# Altium project RFID_Reader_Z69.PrjPcb
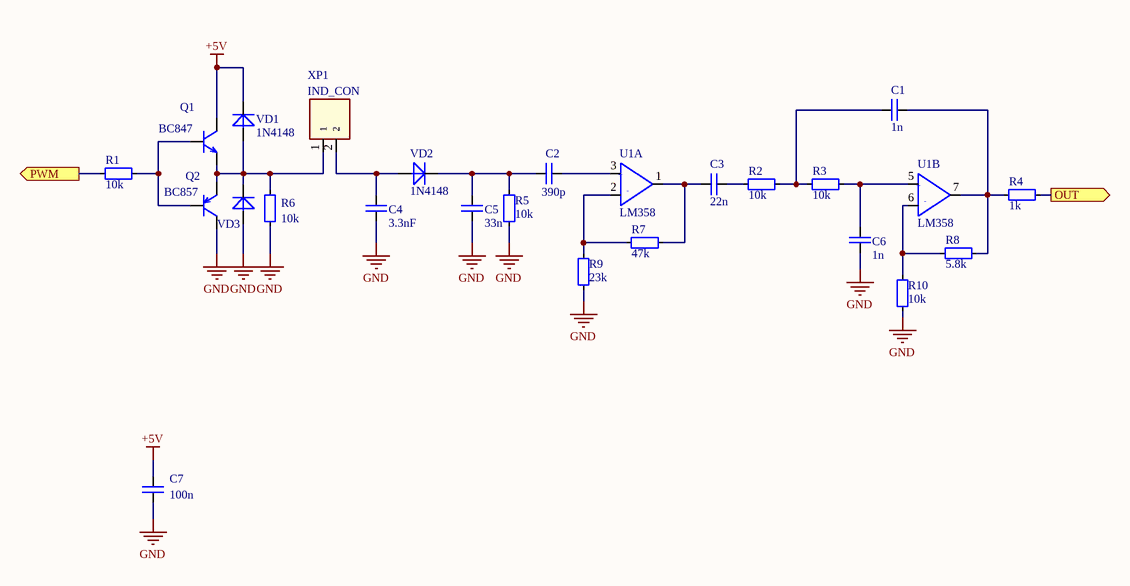
[diagram p0: Analog.SchDoc]
2 sheets, 55 parts. Net scope: flat (ports and power ports of the same name join across sheets).
Board file: PCB.PcbDoc
Sheets:
  Analog.SchDoc
  MCU.SchDoc

## Sheet Analog.SchDoc
size A4

### Parts
C1  1n  [SMD_0805]
C2  390p  [SMD_0805]
C3  22n  [SMD_0805]
C4  3.3nF  [SMD_0805]
C5  33n  [SMD_0805]
C6  1n  [SMD_0805]
C7  100n  [SMD_0805]
Q1  BC847  [SOT23-3PIN]
Q2  BC857  [SOT23-3PIN]
R1  10k  [SMD_1206]
R2  10k  [SMD_0805]
R3  10k  [SMD_0805]
R4  1k  [SMD_1206]
R5  10k  [SMD_0805]
R6  10k  [SMD_0805]
R7  47k  [SMD_0805]
R8  5.8k  [SMD_0805]
R9  23k  [SMD_0805]
R10  10k  [SMD_0805]
U1  LM358  [SO8-150mil]  (parts A,B of 2)
VD1  1N4148  [DIO-MELF_SOD-80]
VD2  1N4148  [DIO-MELF_SOD-80]
VD3  1N4148  [DIO-MELF_SOD-80]  (value not drawn)
XP1  IND_CON  [PIN-HEAD-1/2/2.54]

### Ports
OUT (out), PWM (out)

### Nets
+5V: C7.2 Q1.3(C) U1.8(VCC) VD1.1(C)
GND: C4.1 C5.1 C6.1 C7.1 Q2.3(C) R5.2 R6.2 R9.2 R10.2 U1.4(GND) VD3.2(A)
OUT: R4.1 ; port OUT
PWM: R1.1 ; port PWM
NetC1_1: C1.1 R2.1 R3.2
NetC1_2: C1.2 R4.2 R8.1 U1.7
NetC2_1: C2.1 C5.2 R5.1 VD2.1(C)
NetC2_2: C2.2 U1.3
NetC3_1: C3.1 R7.1 U1.1
NetC3_2: C3.2 R2.2
NetC4_2: C4.2 VD2.2(A) XP1.2
NetC6_2: C6.2 R3.1 U1.5
NetQ1_1: Q1.1(B) Q2.1(B) R1.2
NetQ1_2: Q1.2(E) Q2.2(E) R6.1 VD1.2(A) VD3.1(C) XP1.1
NetR7_2: R7.2 R9.1 U1.2
NetR8_2: R8.2 R10.1 U1.6

### Notes on the sheet
- (in symbol LM358, part A) +; -
- (in symbol LM358, part B) +; -

### Library data of the parts
C1-C7 = C_NONE_POLAR: None polar capacitor; Case: 0805
  C1 C6: Value: 1n
  C2: Value: 390p
  C3: Value: 22n
  C4: Value: 3.3nF
  C5: Value: 33n
  C7: Value: 100n
Q1 = BC847: NPN; Manufacture: NXP; Model: BC847; Case: SOT-23; HelpURL: https://assets.nexperia.com/documents/data-sheet/BC847_SER.pdf
Q2 = BC857: PNP; Manufacture: NXP; Model: BC857; Case: SOT-23; HelpURL: https://assets.nexperia.com/documents/data-sheet/BC856_BC857_BC858.pdf
R1-R10 = RES: Resistor; Case: 0805
  R1-R3 R5 R6 R10: Value: 10k
  R4: Value: 1k
  R7: Value: 47k
  R8: Value: 5.8k
  R9: Value: 23k
U1 = LM358: OpAmp; Manufacture: TI; Case: SOIC-8; HelpURL: http://www.ti.com/lit/ds/symlink/lm158-n.pdf; Model: LM358
VD1-VD3 = DIODE: Value: 1N4148
  VD1 VD3: Case: *
  VD2: Case: 0805
XP1 = CON_2

## Sheet MCU.SchDoc
size A4
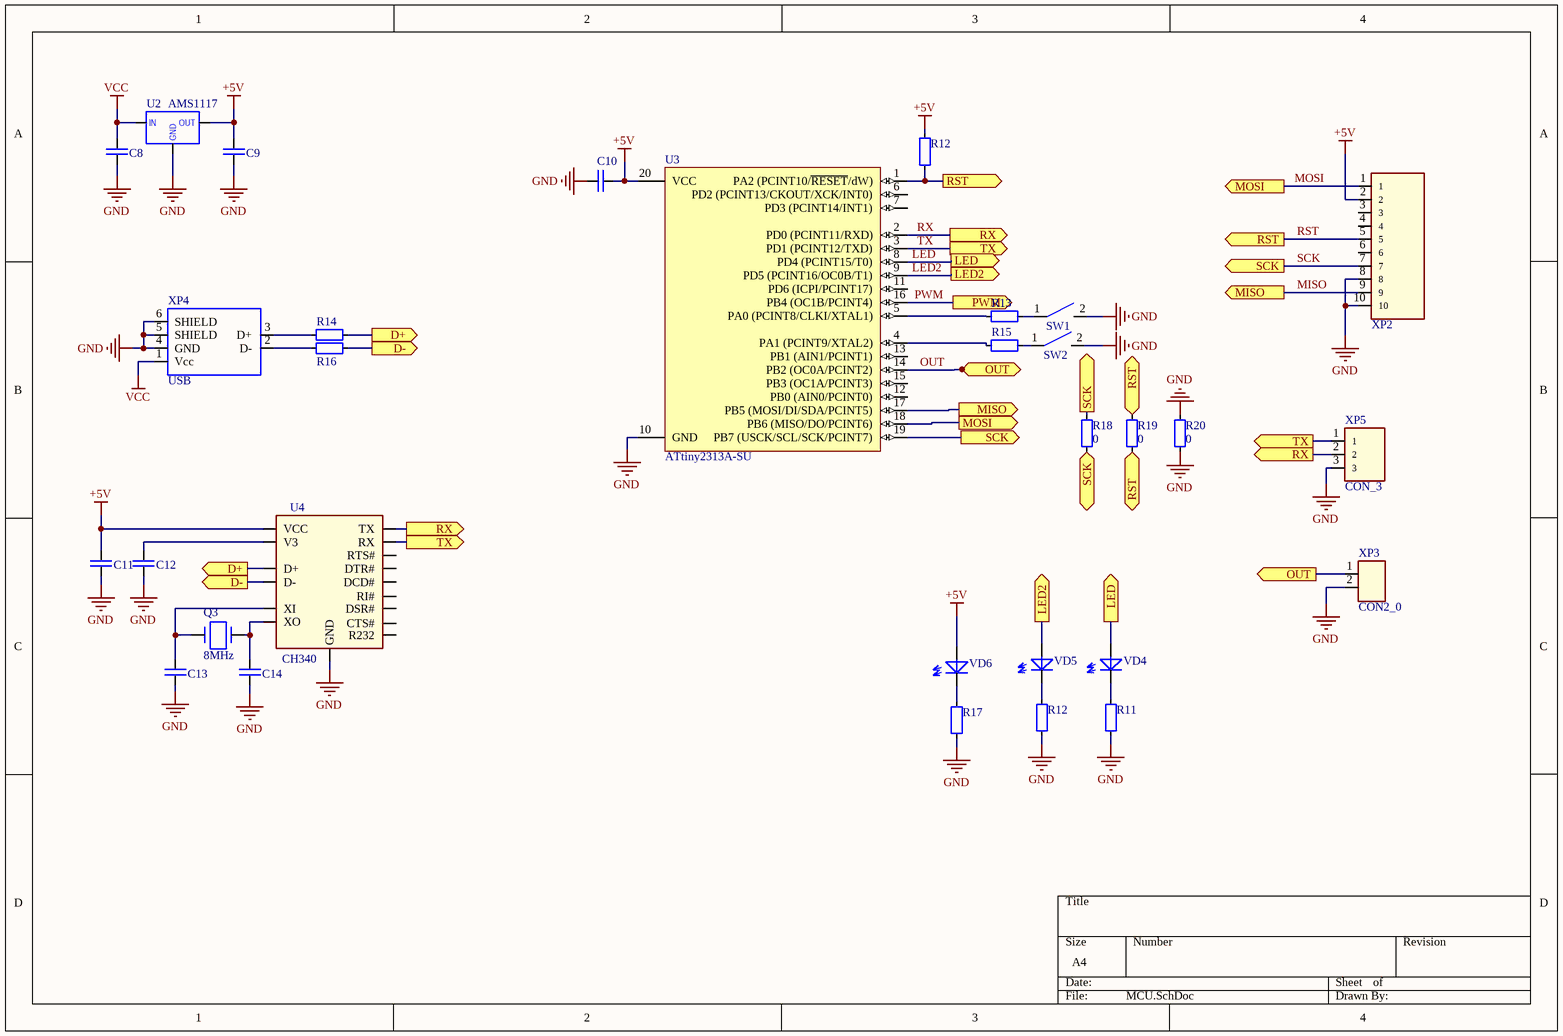
[diagram p1: MCU.SchDoc]

### Parts
(Parts that share a designator on the sheet are numbered #1, #2 ... from top to bottom, then left to right.)
C8  (no value)  [SMD_1206]
C9  (no value)  [SMD_1206]
C10  (no value)  [SMD_1206]
C11  (no value)  [SMD_0805]
C12  (no value)  [SMD_0805]
C13  (no value)  [SMD_0805]
C14  (no value)  [SMD_0805]
Q3  8MHz  [QUARTZ]
R11  (no value)  [SMD_0805]
R12#1  (no value)  [SMD_0805]
R12#2  (no value)  [SMD_0805]
R13  (no value)  [SMD_0805]
R14  (no value)  [SMD_0805]
R15  (no value)  [SMD_0805]
R16  (no value)  [SMD_0805]
R17  (no value)  [SMD_0805]
R18  0  [SMD_1206]
R19  0  [SMD_1206]
R20  0  [SMD_1206]
SW1  SW  [SWITCH]  (value not drawn)
SW2  SW  [SWITCH]  (value not drawn)
U2  AMS1117  [SOT-223]
U3  ATtiny2313A-SU  [SOP20-300mil]
U4  CH340  [SOIC-16]
VD4  (no value)  [LED-3mm]
VD5  (no value)  [LED-3mm]
VD6  (no value)  [LED-3mm]
XP2  CON_10  [BH10]  (value not drawn)
XP3  CON2_0  [HEAD-1/2/2.54]
XP4  USB  [USB/SM0.8-6H5]
XP5  CON_3  [HEAD-1/3/2.54]

### Ports
D+ (out), D- (out), LED2 (out), LED (out), MISO (out), MOSI (out), OUT (out), PWM (out), RST (out), RX (out), SCK (out), TX (out)

### Nets
1: SW1.3 SW2.3
2: SW1.4 SW2.4
+5V: C9.1 C10.2 C11.2 R12#1.1 U2.2(OUT) U2.4 U3.20(VCC) U4.16(VCC) VD6.2(A) XP2.2
GND: C8.2 C9.2 C10.1 C11.1 C12.1 C13.1 C14.1 R11.2 R12#2.2 R17.2 R20.1 R20.2 SW1.2 SW2.2 U2.1(GND) U3.10(GND) U4.1(GND) XP2.8 XP2.10 XP3.2 XP4.4(GND) XP4.5(SHIELD) XP4.6(SHIELD) XP5.3
VCC: C8.1 U2.3(IN) XP4.1(Vcc)
LED: U3.8(PD4_(PCINT15/T0)) VD4.2(A) ; port LED
LED2: U3.9(PD5_(PCINT16/OC0B/T1)) VD5.2(A) ; port LED2
MISO: U3.17(PB5_(MOSI/DI/SDA/PCINT5)) XP2.9 ; port MISO
MOSI: U3.18(PB6_(MISO/DO/PCINT6)) XP2.1 ; port MOSI
OUT: U3.14(PB2_(OC0A/PCINT2)) XP3.1 ; port OUT
PWM: U3.16(PB4_(OC1B/PCINT4)) ; port PWM
RST: R12#1.2 R19.1 R19.2 U3.1(PA2_(PCINT10/~{RESET}/dW)) XP2.5 ; port RST
RX: U3.2(PD0_(PCINT11/RXD)) U4.2(TX) XP5.2 ; port RX
SCK: R18.1 R18.2 U3.19(PB7_(USCK/SCL/SCK/PCINT7)) XP2.7 ; port SCK
TX: U3.3(PD1_(PCINT12/TXD)) U4.3(RX) XP5.1 ; port TX
NetC12_2: C12.2 U4.4(V3)
NetC13_2: C13.2 Q3.1 U4.7(XI)
NetC14_2: C14.2 Q3.2 U4.8(XO)
NetR11_1: R11.1 VD4.1(C)
NetR12#2_1: R12#2.1 VD5.1(C)
NetR13_1: R13.1 SW1.1
NetR13_2: R13.2 U3.5(PA0_(PCINT8/CLKI/XTAL1))
NetR14_1: R14.1 U4.5(D+) ; port D+
NetR14_2: R14.2 XP4.3(D+)
NetR15_1: R15.1 SW2.1
NetR15_2: R15.2 U3.4(PA1_(PCINT9/XTAL2))
NetR16_1: R16.1 U4.6(D-) ; port D-
NetR16_2: R16.2 XP4.2(D-)
NetR17_1: R17.1 VD6.1(C)

Not connected (* = marked no-connect by the designer): U3 6(PD2_(PCINT13/CKOUT/XCK/INT0)) 7(PD3_(PCINT14/INT1)) 11(PD6_(ICPI/PCINT17)) 12(PB0_(AIN0/PCINT0)) 13(PB1_(AIN1/PCINT1)) 15(PB3_(OC1A/PCINT3)); U4 9(CTS#) 10(DSR#) 11(RI#) 12(DCD#) 13(DTR#) 14(RTS#) 15(R232); XP2 3 4 6

### Library data of the parts
C8-C14 = C_NONE_POLAR: None polar capacitor; Case: *
Q3 = CRYSTAL: Crystal oscillator; Value: 8MHz
R11 R12#1 R12#2 R13-R20 = RES: Resistor; Case: *
  R18-R20: Value: 0
SW1 SW2 = SW: Switch
U2 = AMS1117: Linear voltage regulator
U3 = ATtiny2313A-SU: 8-bit AVR Microcontroller, 1.8-5.5V, 2KB Flash, 128 Bytes EEPROM, 128 Bytes SRAM, 20-pin SOIC, Industrial Grade (-40°C to 85°C), Pb-Free; Published: 1-Apr-2010; DatasheetVersion: revA, Dec-2009; PackageVersion: revA, Jan-2002; PackageReference: 20S; Publisher: Altium Limited; PackageDescription: 20-lead, 0.300" Wide Body, Plastic Gull Wing Small Outline Package (SOIC); Supplier 1: Digi-Key; Supplier Part Number 1: ATTINY2313A-SU-ND; Supplier 2: Mouser; Supplier Part Number 2: 556-ATTINY2313A-SU; Code_JEDEC: MS-013-AC; Code_IPC: SOIC127P1030-20; ComponentLink1Description: Manufacturer Link; ComponentLink1URL: http://www.atmel.com/products/avr/default.asp?; ComponentLink2Description: ATtiny2313A/4313 Datasheet; ComponentLink2URL: http://www.atmel.com/dyn/resources/prod_documents/doc8246.pdf; ComponentLink3Description: ATtiny2313A/4313 Summary; ComponentLink3URL: http://www.atmel.com/dyn/resources/prod_documents/8246S.pdf; ComponentLink4Description: Atmel.com Home; ComponentLink4URL: http://www.atmel.com
VD4-VD6 = LED

## Nets that join several sheets
+5V: Analog (C7.2 Q1.3 U1.8 VD1.1), MCU (10 pins)
GND: Analog (11 pins), MCU (24 pins)
OUT: Analog (R4.1), MCU (U3.14 XP3.1)
PWM: Analog (R1.1), MCU (U3.16)